# EAGLE schematic StoneWS_v2 (EAGLE 9.6.2)
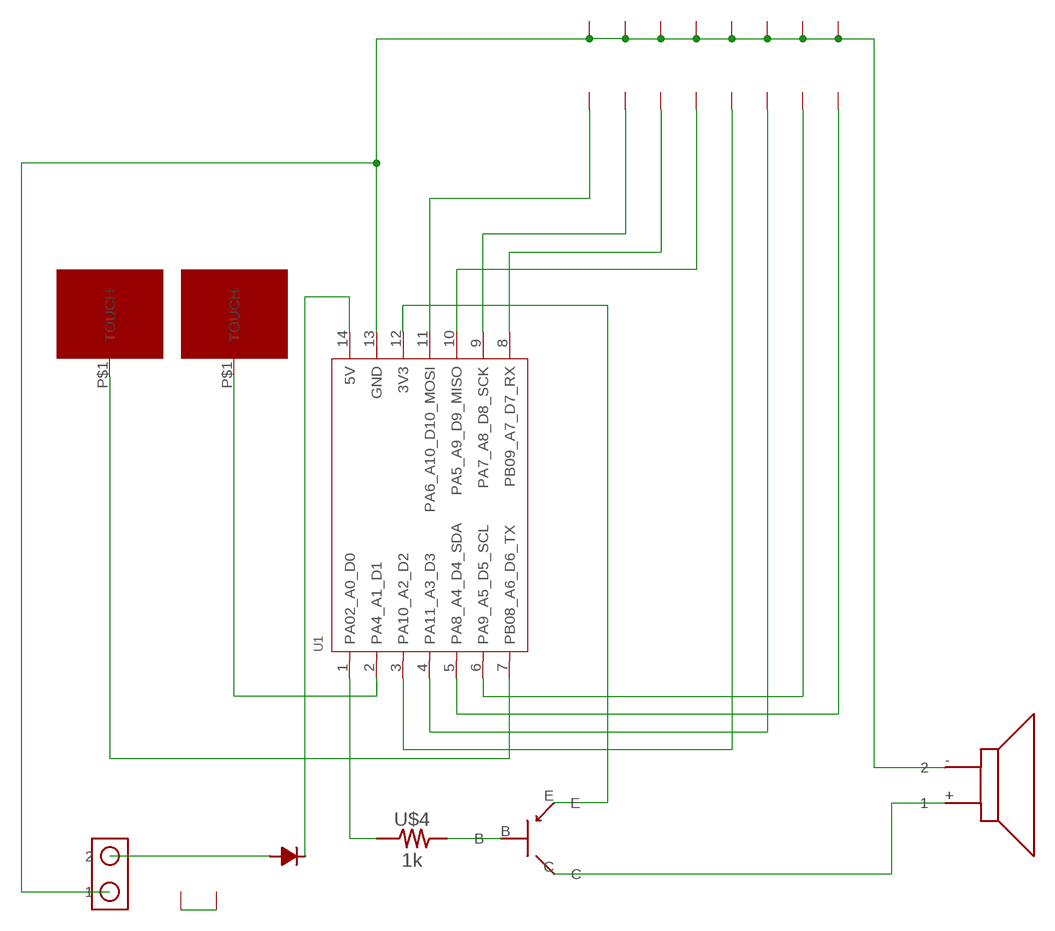
[diagram p0: schematic, sheet 1]

## Parts
U1  MOUDLE-SEEEDUINO-XIAO  [MOUDLE14P-2.54-21X17.8MM]
U$1  EH2-SMALL-OFFSET  [EH2_SMALL-OFFSET]
U$2  SPEAKER  [SPEAKER]
U$3  TR-PNP  [TR-PNP]
U$4  1k  RESISTOR-1608  [RESC1608X70N]
U$6  DIODE-SS2040L  [DIODE-SS2040L]
U$7  TOUCH-PTN-FL1  [TOUCH-FLAT1]
U$8  TOUCH-PTN-FL1  [TOUCH-FLAT1]
U$9  M-LOGO  [M-LOGO]
U$10  DIPSWITCH-8  [DIPSWITCH-8]

## Nets
N$1: U1.2(PA4_A1_D1) U$7.P$1(TOUCH)
N$2: U1.11(PA6_A10_D10_MOSI) U$10.21
N$3: U$1.2 U$6.P$1
N$4: U$3.B U$4.2
N$5: U1.12(3V3) U$3.E
N$6: U1.14(5V) U$6.P$2
N$7: U1.7(PB08_A6_D6_TX) U$8.P$1(TOUCH)
N$8: U1.1(PA02_A0_D0) U$4.1
N$9: U1.13(GND) U$1.1 U$2.- U$10.11 U$10.12 U$10.13 U$10.14 U$10.15 U$10.16 U$10.17 U$10.18
N$10: U1.9(PA7_A8_D8_SCK) U$10.22
N$11: U$9.P$1 U$9.P$2
N$12: U1.10(PA5_A9_D9_MISO) U$10.24
N$13: U1.3(PA10_A2_D2) U$10.25
N$14: U1.4(PA11_A3_D3) U$10.26
N$15: U1.5(PA8_A4_D4_SDA) U$10.28
N$16: U1.6(PA9_A5_D5_SCL) U$10.27
N$17: U$2.+ U$3.C
N$19: U1.8(PB09_A7_D7_RX) U$10.23

## Library data of the parts
U1 = Seeeduino XIAO:MOUDLE-SEEEDUINO-XIAO
U$1 = Mathrax:EH2
U$2 = MATHRAX-standard:SPEAKER
U$3 = Mathrax:TR-PNP
U$4 = Mathrax:RESISTOR
U$6 = Mathrax:DIODE
U$7 U$8 = Mathrax:TOUCH-PTN
U$9 = Mathrax:M-LOGO
U$10 = Mathrax:DIPSWITCH-8